# EAGLE design esp12rgbww_pow (EAGLE 7.7.0)
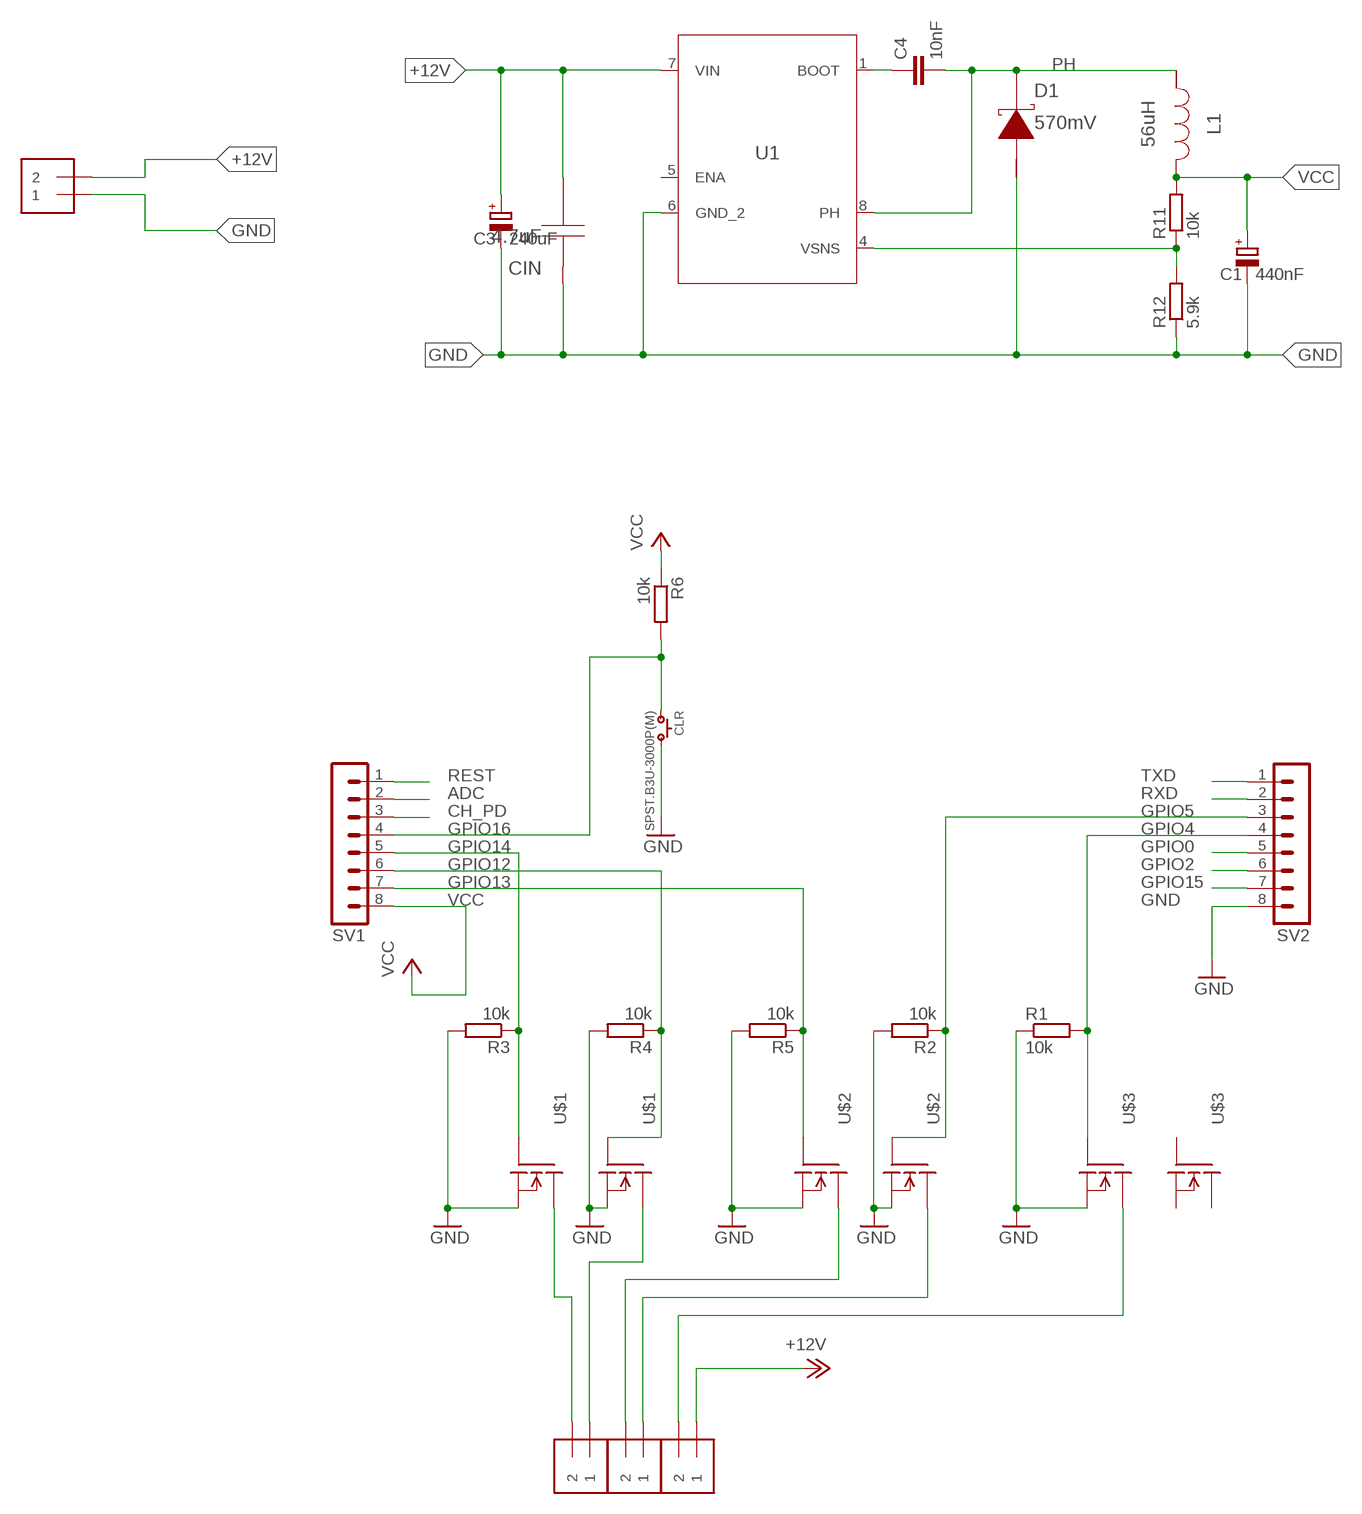
[diagram p0: schematic, sheet 1]

## Parts
C1  440nF  CPOL-EUE2.5-7  [E2,5-7]
C3  240uF  CPOL-EUE2.5-7  [E2,5-7]
C4  10nF  C-EUC0805  [C0805]
CIN  4.7uF  GRM31CR71H475KA12L  [1206]
CLR  SPST.B3U-3000P(M)  [B3U-3000P(M)]
D1  570mV  B160-13-F  [SMA]
J1  1X2-3.5MM  [1X2-3.5MM]
J2  1X2-3.5MM  [1X2-3.5MM]
J3  1X2-3.5MM  [1X2-3.5MM]
J4  1X2-3.5MM  [1X2-3.5MM]
L1  56uH  NPI75C560KTRF  [IND_NPI75C]
R1  10k  R-EU_R0805  [R0805]
R2  10k  R-EU_R0805  [R0805]
R3  10k  R-EU_R0805  [R0805]
R4  10k  R-EU_R0805  [R0805]
R5  10k  R-EU_R0805  [R0805]
R6  10k  R-EU_R0805  [R0805]
R11  10k  R-EU_R0805  [R0805]
R12  5.9k  R-EU_R0805  [R0805]
SV1  MA08-1  [MA08-1]
SV2  MA08-1  [MA08-1]
U1  TPS5410DR  [M08A]
U$1  AOD4806  [SO08]
U$2  AOD4806  [SO08]
U$3  AOD4806  [SO08]

## Nets
+12V: C3.+ CIN.2 J3.1 J4.2 U1.7(VIN)
ADC: SV1.2
B: J1.2 U$1.7(D1) U$1.8(D1)
BOOT: C4.1 U1.1(BOOT)
CH_PD: SV1.3
CW: J2.1 U$2.5(D) U$2.6(D)
G: J1.1 U$1.5(D) U$1.6(D)
GND: C1.- C3.- CIN.1 CLR.2 D1.2(A) J4.1 R1.1 R2.2 R3.2 R4.2 R5.2 R12.1 SV2.8 U1.6(GND_2) U$1.1(S1) U$1.3(S) U$2.1(S1) U$2.3(S) U$3.1(S1)
GPIO0: SV2.5
GPIO2: SV2.6
GPIO4: R1.2 SV2.4 U$3.2(G1)
GPIO5: R2.1 SV2.3 U$2.4(G)
GPIO12: R4.1 SV1.6 U$1.4(G)
GPIO13: R5.1 SV1.7 U$2.2(G1)
GPIO14: R3.1 SV1.5 U$1.2(G1)
GPIO15: SV2.7
GPIO16: CLR.1 R6.2 SV1.4
PH: C4.2 D1.1(K) L1.2 U1.8(PH)
R: J2.2 U$2.7(D1) U$2.8(D1)
REST: SV1.1
RXD: SV2.2
SENS: R11.1 R12.2 U1.4(VSNS)
TXD: SV2.1
VCC: C1.+ L1.1 R6.1 R11.2 SV1.8
WW: J3.2 U$3.7(D1) U$3.8(D1)
Unconnected: U1.5(ENA) U$3.3(S) U$3.4(G) U$3.5(D) U$3.6(D)

## Library data of the parts
C1 C3 = resistor:CPOL-EU: POLARIZED CAPACITOR, European symbol
C4 = resistor:C-EU: CAPACITOR, European symbol
CIN = AcceleratedDesigns_Lib:GRM31CR71H475KA12L; CAP: 4.7E6; ESR: 0.0; IRMS: 0.0; MANUFACTURER_NAME: MuRata; MANUFACTURER_PART_NUMBER: GRM31CR71H475KA12L; VDC: 50.0; VENDOR: MuRata
CLR = omron:SPST
D1 = TI_Accelerated_Design_neu:B160-13-F; DATASHEETURL: httpwww.diodes.comdatasheetsds13002.pdf; IO: 1.0; MANUFACTURER_NAME: Diodes Inc.; MANUFACTURER_PART_NUMBER: B16013F; VENDOR: Diodes Inc.; VFATIO: 0.7; VRRM: 60.0
J1-J4 = adafruit:1X2: 3.5mm Terminal block http://www.ladyada.net/library/pcb/eaglelibrary.html
L1 = AcceleratedDesigns_Lib:NPI75C560KTRF; DCR: 0.24; IDC: 0.94; L: 5.6E5; MANUFACTURER_NAME: NIC Components; MANUFACTURER_PART_NUMBER: NPI75C560KTRF; VENDOR: NIC Components
R1-R6 = rcl:R-EU_: RESISTOR, European symbol
R11 R12 = resistor:R-EU_: RESISTOR, European symbol
SV1 SV2 = con-lstb:MA08-1: PIN HEADER; OC_FARNELL: unknown; OC_NEWARK: unknown
U1 = AcceleratedDesigns_Lib:TPS5410DR; DATASHEETURL: httpwww.ti.comproducttps5410; FREQUENCY: 500000.0; IMAX: 1.0; MANUFACTURER_NAME: Texas Instruments; MANUFACTURER_PART_NUMBER: TPS5410DR; MKTG_PACKAGE: TPS5410; NSID: TPS5410D; PACKAGE: TPS5410; VENDOR: Texas Instruments
U$1-U$3 = esp12_RGBWW:AOD4806

## Net classes
5 Signal: width 0.381 mm

## Board
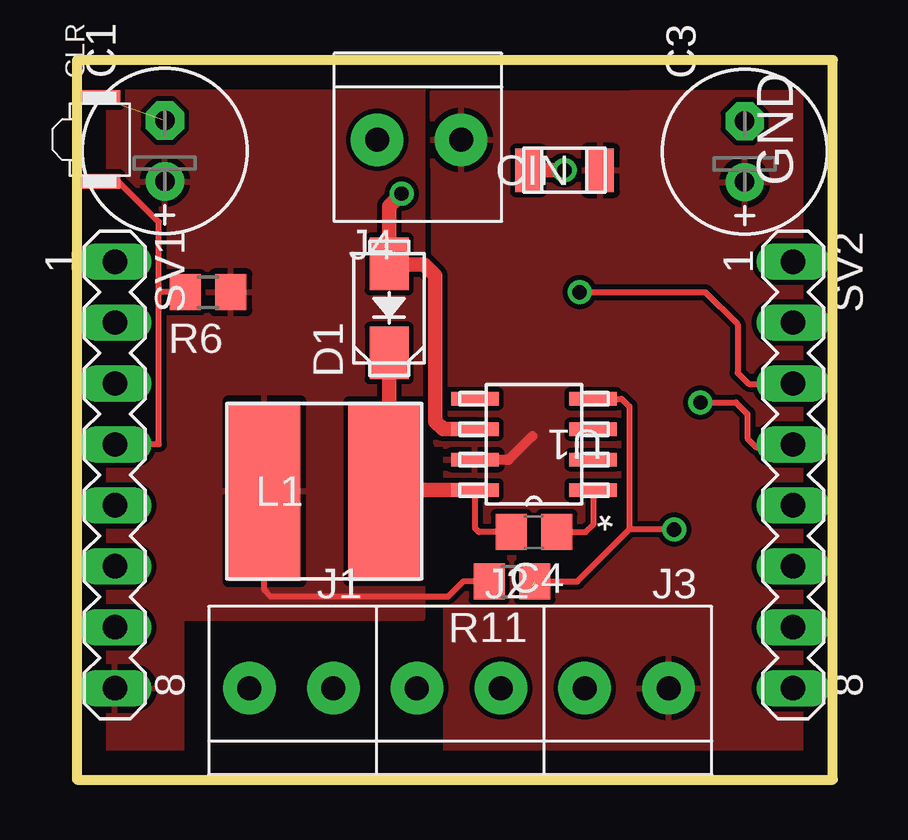
[diagram p1: board, top side]
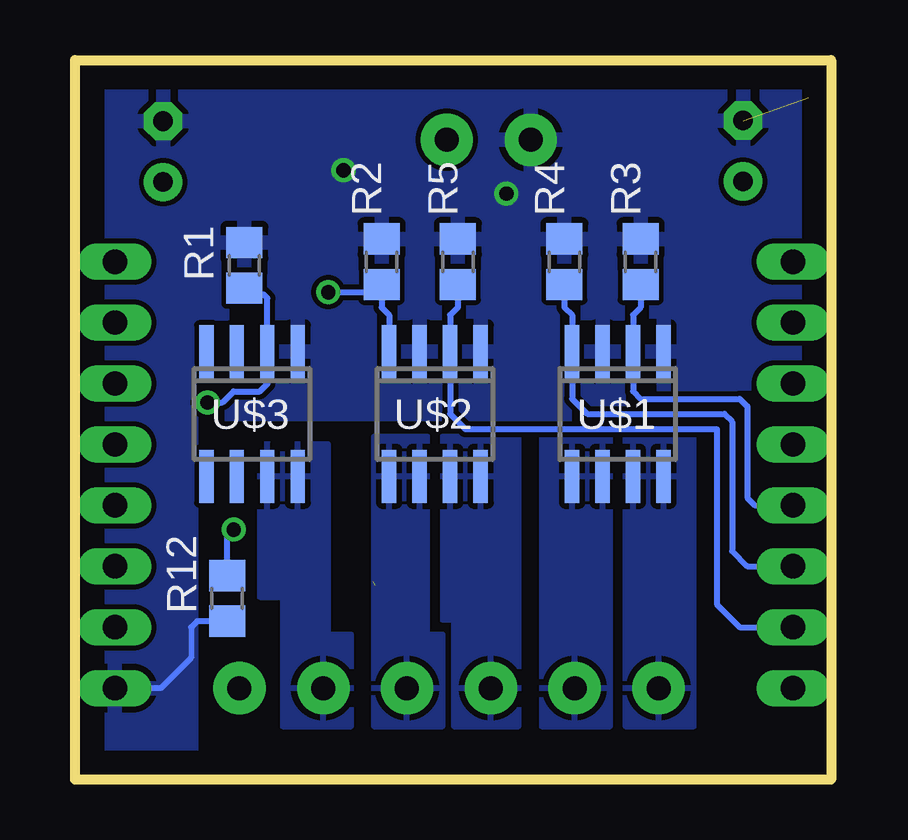
[diagram p2: board, bottom side, seen from below]

Size 31.5 x 30 mm. Coordinates in mm from the lower left corner, seen from the top.
Outline: 0,0 31.5,0 31.5,30 0,30 0,0
Copper layers (1*16): Top 0.035mm / dielectric 1.5mm / Bottom 0.035mm
Design rules "default": minimum track width 10mil, minimum drill 24mil, track to track 8mil, track to pad 8mil, pad to pad 8mil, via to via 8mil, smd to smd 8mil, copper to edge 40mil, drill to drill 8mil, minimum pad ring 10mil, minimum via ring 8mil, stop-mask expansion 4mil, vias tented up to drill 0mil, thermal gap 10mil

### Footprints (pad centres in the part's own frame; a part is rotated, then mirrored left to right if it is on the bottom)
E2,5-7 = drill 0.813 pad 1.6: + -1.27,0 | drill 0.813 pad 1.6 octagon: - 1.27,0
C0805 = smd 1.3 x 1.5: 1 -0.95,0; 2 0.95,0
1206 = smd 1.118 x 1.803: 1 -1.499,0; 2 1.499,0
B3U-3000P(M) = smd 0.6 x 1.7: 1 -1.75,0; 2 1.75,0
SMA = smd 2.184 x 1.626: 1 -1.854,0; 2 1.854,0
1X2-3.5MM = drill 1 pad 2.184: 1 1.8,0; 2 -1.7,0
IND_NPI75C = smd 2.997 x 7.493: 1 -2.502,0; 2 2.502,0
R0805 = smd 1.3 x 1.5: 1 -0.95,0; 2 0.95,0
MA08-1 = drill 1.016 long: 1 -8.89,0; 2 -6.35,0; 3 -3.81,0; 4 -1.27,0; 5 1.27,0; 6 3.81,0; 7 6.35,0; 8 8.89,0
M08A = smd 1.981 x 0.559: 1 -2.464,1.905; 2 -2.464,0.635; 3 -2.464,-0.635; 4 -2.464,-1.905; 5 2.464,-1.905; 6 2.464,-0.635; 7 2.464,0.635; 8 2.464,1.905
SO08 = smd 0.6 x 2.2: 1 -1.905,-2.6; 2 -0.635,-2.6; 3 0.635,-2.6; 4 1.905,-2.6; 5 1.905,2.6; 6 0.635,2.6; 7 -0.635,2.6; 8 -1.905,2.6

### Placement (x,y rotation side)
C1  3.67,26.2 90 top
C3  27.83,26.18 90 top
C4  19.05,10.32 180 top
CIN  20.32,25.4 0 top
CLR  0.95,26.68 90 top
D1  13.01,19.64 90 top
J1  8.89,3.81 0 top
J2  15.88,3.81 0 top
J3  22.86,3.81 0 top
J4  14.32,26.67 180 top
L1  10.32,12.02 0 top
R1  24.45,21.43 270 bottom
R2  18.73,21.59 90 bottom
R3  7.94,21.59 90 bottom
R4  11.11,21.59 90 bottom
R5  15.56,21.59 90 bottom
R6  5.47,20.32 180 top
R11  18.13,8.26 180 top
R12  25.17,7.55 90 bottom
SV1  1.59,12.7 270 top
SV2  29.84,12.7 270 top
U1  19.05,13.97 180 top
U$1  8.89,15.24 180 bottom
U$2  16.51,15.24 180 bottom
U$3  24.13,15.24 180 bottom

### Tracks (layer width: path | path; a pad name or v marks a point on that pad's centre or on a via)
+12V
  Top 0.406: U1.7 18,13.34 18.98,14.31
  pour Top: 15.4,13.99 14.98,13.99 14.83,28.62 31.28,28.66 31.75,0 15.4,0
B
  pour Bottom: 8.57,14.29 8.57,2.22 5.71,2.22 5.71,14.29
BOOT
  Top 0.254: U1.1 21.51,10.62 21.21,10.32 C4.1
CW
  pour Bottom: 19.05,14.29 19.05,2.22 16.19,2.22 16.19,6.03 16.83,6.03 16.83,14.29
G
  pour Bottom: 12.06,14.29 12.06,2.22 9.21,2.22 9.21,14.29
GND  (via drill 0.6)  (1 unrouted)
  Top 0.61: U1.6 15.27,14.61 14.94,14.94 14.94,21 14.47,21.47 13.04,21.47 D1.2 13.01,23.9 v13.54,24.43 13.48,24.37 | v20.32,25.4 CIN.1
  Bottom 0.254: R12.1 26.42,6.6 26.67,6.35 26.67,5.08 27.94,3.81 SV2.8
  pour Bottom: 0,30.48 31.75,30.48 31.75,1.27 26.67,1.27 26.67,15.24 0,15.24
GPIO4  (via drill 0.6)
  Top 0.254: SV2.4 29.72,13.85 28.32,13.85 27.94,14.22 27.94,15.24 27.46,15.72 v25.98,15.72
  Bottom 0.254: v25.98,15.72 25.35,15.72 24.89,16.18 23.8,16.18 23.49,16.49 U$3.2 23.5,20.07 23.65,20.23 24.19,20.23 R1.2
GPIO5  (via drill 0.6)
  Top 0.254: v20.95,20.32 26.2,20.32 27.54,18.98 27.54,16.96 28,16.49 29.83,16.49 SV2.3
  Bottom 0.254: U$2.4 18.41,19.37 18.73,19.68 R2.1 19.05,20.32 v20.95,20.32
GPIO12
  Bottom 0.254: SV1.6 3.49,8.89 4.13,9.53 4.13,14.92 4.45,15.24 10.16,15.24 10.79,15.88 U$1.4 10.79,19.37 11.11,19.68 R4.1
GPIO13
  Bottom 0.254: SV1.7 3.81,6.35 4.76,7.3 4.76,14.61 15.24,14.61 15.88,15.24 U$2.2 15.88,19.37 15.56,19.68 R5.1
GPIO14
  Bottom 0.254: SV1.5 3.17,11.43 3.49,11.75 3.49,15.56 3.81,15.88 7.94,15.88 8.26,16.19 U$1.2 8.26,19.37 7.94,19.68 R3.1
GPIO16
  Top 0.254: SV1.4 3.42,13.97 3.42,20.32 | CLR.1 1.74,24.93 3.42,23.25 3.42,20.32 | R6.2 3.43,20.32 3.42,20.32
PH
  Top 0.254: U1.8 16.59,10.48 16.75,10.32 C4.2
  Top 0.61: U1.8 13.48,12.06 L1.2 12.82,14.53 13.03,15.13 | 13.07,15.25 13.03,15.13 | D1.1 13.03,17.77 13.03,15.13
R
  pour Bottom: 16.19,14.29 16.19,6.67 15.72,6.67 15.72,2.22 13.02,2.22 13.02,14.29
SENS  (via drill 0.6)  (1 unrouted)
  Top 0.254: v24.89,10.42 23.02,10.42 | 18.99,8.09 18.98,8.1 | R11.1 20.86,8.26 23.02,10.42 | U1.4 22.71,15.88 23.02,15.56 23.02,10.42
  Bottom 0.254: R12.2 25.17,10.15 v24.89,10.42
VCC
  Top 0.254: L1.1 7.81,7.9 8.09,7.62 8.89,7.62 15.46,7.62 16.09,8.26 R11.2
  Top 0.406: 8.16,11.75 L1.1
  pour Top: 0,29.21 14.39,29.21 14.39,6.72 4.36,6.72 4.36,0.62 0,0.62
WW
  pour Bottom: 23.81,13.97 23.81,7.62 22.86,7.62 22.86,2.22 20,2.22 20,6.03 20.95,6.03 20.95,13.97

### Text on the board
tNames: GND